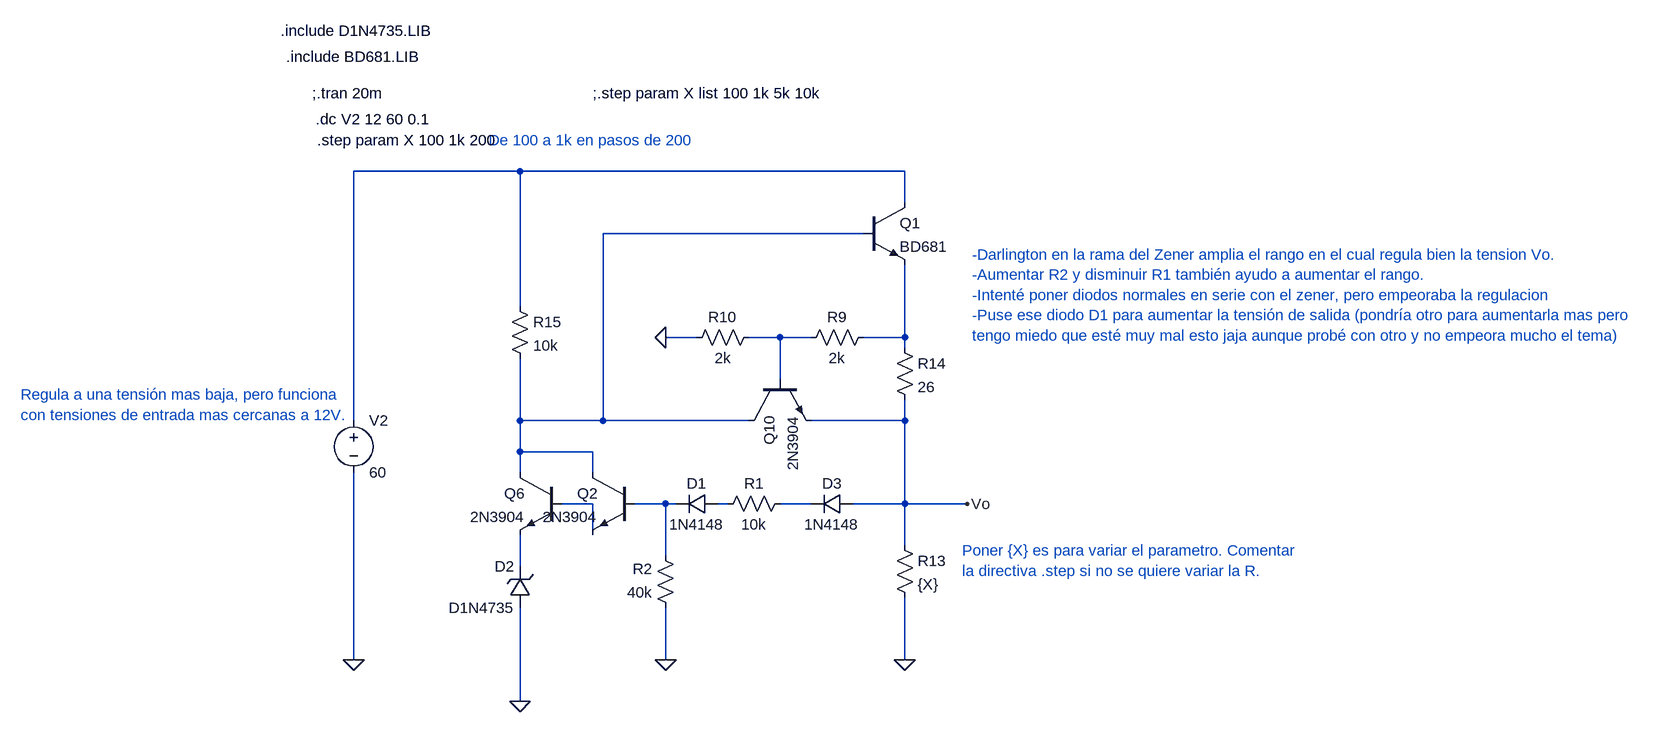
[diagram p0: schematic ReguladorConLimitador_MenorVo_MayorRangoDeRegulacion.asc]
ReguladorConLimitador_MenorVo_MayorRangoDeRegulacion.asc, the LTspice schematic file:
Version 4
SHEET 1 4512 680
WIRE 2624 -816 2368 -816
WIRE 3216 -816 2624 -816
WIRE 3216 -768 3216 -816
WIRE 3152 -720 2752 -720
WIRE 2624 -608 2624 -816
WIRE 2896 -560 2848 -560
WIRE 3024 -560 2976 -560
WIRE 3072 -560 3024 -560
WIRE 3216 -560 3216 -672
WIRE 3216 -560 3152 -560
WIRE 3216 -544 3216 -560
WIRE 3024 -496 3024 -560
WIRE 2368 -432 2368 -816
WIRE 2624 -432 2624 -528
WIRE 2752 -432 2752 -720
WIRE 2752 -432 2624 -432
WIRE 2976 -432 2752 -432
WIRE 3216 -432 3216 -464
WIRE 3216 -432 3072 -432
WIRE 2624 -384 2624 -432
WIRE 2736 -384 2624 -384
WIRE 2624 -352 2624 -384
WIRE 2736 -352 2736 -384
WIRE 2736 -304 2688 -304
WIRE 2848 -304 2800 -304
WIRE 2864 -304 2848 -304
WIRE 2944 -304 2928 -304
WIRE 3072 -304 3024 -304
WIRE 3216 -304 3216 -432
WIRE 3216 -304 3136 -304
WIRE 3312 -304 3216 -304
WIRE 2736 -256 2736 -304
WIRE 3216 -240 3216 -304
WIRE 2848 -224 2848 -304
WIRE 2624 -208 2624 -256
WIRE 2368 -64 2368 -352
WIRE 2848 -64 2848 -144
WIRE 3216 -64 3216 -160
WIRE 2624 0 2624 -144
FLAG 2848 -64 0
FLAG 3216 -64 0
FLAG 2848 -560 0
FLAG 2368 -64 0
FLAG 3312 -304 Vo
FLAG 2624 0 0
SYMBOL voltage 2368 -448 R0
WINDOW 123 0 0 Left 2
WINDOW 39 0 0 Left 2
SYMATTR InstName V2
SYMATTR Value 60
SYMBOL npn 2976 -496 M90
SYMATTR InstName Q10
SYMATTR Value 2N3904
SYMBOL res 3168 -576 R90
WINDOW 0 0 56 VBottom 2
WINDOW 3 32 56 VTop 2
SYMATTR InstName R9
SYMATTR Value 2k
SYMBOL res 2992 -576 R90
WINDOW 0 0 56 VBottom 2
WINDOW 3 32 56 VTop 2
SYMATTR InstName R10
SYMATTR Value 2k
SYMBOL res 3040 -320 R90
WINDOW 0 0 56 VBottom 2
WINDOW 3 32 56 VTop 2
SYMATTR InstName R1
SYMATTR Value 10k
SYMBOL res 2864 -128 R180
WINDOW 0 36 76 Left 2
WINDOW 3 36 40 Left 2
SYMATTR InstName R2
SYMATTR Value 40k
SYMBOL res 3200 -560 R0
SYMATTR InstName R14
SYMATTR Value 26
SYMBOL zener 2640 -144 R180
WINDOW 0 24 64 Left 2
WINDOW 3 24 0 Left 2
SYMATTR InstName D2
SYMATTR Value D1N4735
SYMATTR Description Diode
SYMATTR Type diode
SYMBOL res 2608 -624 R0
SYMATTR InstName R15
SYMATTR Value 10k
SYMBOL npn 2688 -352 M0
SYMATTR InstName Q6
SYMATTR Value 2N3904
SYMBOL res 3200 -256 R0
SYMATTR InstName R13
SYMATTR Value {X}
SYMBOL npn 3152 -768 R0
SYMATTR InstName Q1
SYMATTR Value BD681
SYMATTR Prefix X
SYMBOL npn 2800 -352 M0
SYMATTR InstName Q2
SYMATTR Value 2N3904
SYMBOL diode 2928 -320 R90
WINDOW 0 0 32 VBottom 2
WINDOW 3 32 32 VTop 2
SYMATTR InstName D1
SYMATTR Value 1N4148
SYMBOL diode 3136 -320 R90
WINDOW 0 0 32 VBottom 2
WINDOW 3 32 32 VTop 2
SYMATTR InstName D3
SYMATTR Value 1N4148
TEXT 2304 -936 Left 2 !;.tran 20m
TEXT 2256 -1032 Left 2 !.include D1N4735.LIB
TEXT 2264 -992 Left 2 !.include BD681.LIB
TEXT 2310 -896 Left 2 !.dc V2 12 60 0.1
TEXT 3320 -688 Left 2 ;-Darlington en la rama del Zener amplia el rango en el cual regula bien la tension Vo.\n-Aumentar R2 y disminuir R1 también ayudo a aumentar el rango.\n-Intenté poner diodos normales en serie con el zener, pero empeoraba la regulacion\n-Puse ese diodo D1 para aumentar la tensión de salida (pondría otro para aumentarla mas pero\ntengo miedo que esté muy mal esto jaja aunque probé con otro y no empeora mucho el tema)
TEXT 3304 -232 Left 2 ;Poner {X} es para variar el parametro. Comentar \nla directiva .step si no se quiere variar la R.
TEXT 2736 -936 Left 2 !;.step param X list 100 1k 5k 10k
TEXT 2576 -864 Left 2 ;De 100 a 1k en pasos de 200
TEXT 2312 -864 Left 2 !.step param X 100 1k 200
TEXT 1856 -472 Left 2 ;Regula a una tensión mas baja, pero funciona \ncon tensiones de entrada mas cercanas a 12V.

The netlist it stands for:
* ReguladorConLimitador_MenorVo_MayorRangoDeRegulacion.asc
V2 N001 0 60
Q10 N002 N003 Vo 0 2N3904
R9 N004 N003 2k
R10 N003 0 2k
R1 N008 N007 10k
R2 0 N006 40k
R14 N004 Vo 26
D2 0 N009 D1N4735
R15 N001 N002 10k
Q6 N002 N005 N009 0 2N3904
R13 Vo 0 {X}
XQ1 N001 N002 N004 BD681  ; pins C B E
Q2 N002 N006 N005 0 2N3904
D1 N007 N006 1N4148
D3 Vo N008 1N4148
.model D D
.lib standard.dio
.model NPN NPN
.model PNP PNP
.lib standard.bjt
;.tran 20m
.include D1N4735.LIB
.include BD681.LIB
.dc V2 12 60 0.1
* -Darlington en la rama del Zener amplia el rango en el cual regula bien la tension Vo.
* -Aumentar R2 y disminuir R1 también ayudo a aumentar el rango.
* -Intenté poner diodos normales en serie con el zener, pero empeoraba la regulacion
* -Puse ese diodo D1 para aumentar la tensión de salida (pondría otro para aumentarla mas pero
* tengo miedo que esté muy mal esto jaja aunque probé con otro y no empeora mucho el tema)
* Poner {X} es para variar el parametro. Comentar
* la directiva .step si no se quiere variar la R.
;.step param X list 100 1k 5k 10k
* De 100 a 1k en pasos de 200
.step param X 100 1k 200
* Regula a una tensión mas baja, pero funciona
* con tensiones de entrada mas cercanas a 12V.
.backanno
.end